# Altium schematic sheet Databus.SchDoc: S88-N Occupancy Detector
size A4; DrawnBy: Sem Kirkels; DocumentNumber: 23P001S01; Revision: V1; SheetNumber: 1; SheetTotal: 6
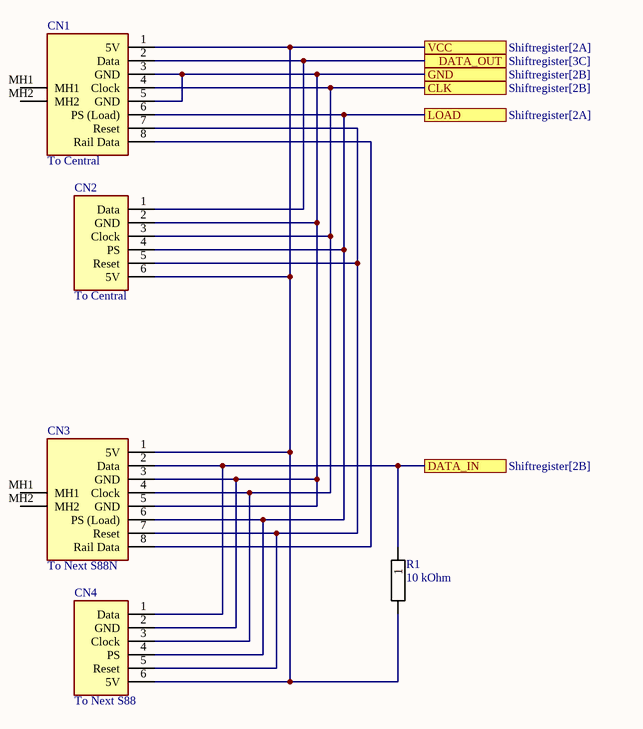
[diagram p0: Databus.SchDoc]

## Parts
CN1  To Central  [RJ45_Connector]
CN2  To Central  [6 pin header]
CN3  To Next S88N  [RJ45_Connector]
CN4  To Next S88  [6 pin header]
R1  10 kOhm  [1N4007]

## Ports
CLK (see Shiftregister[2B]), DATA_IN (see Shiftregister[2B]), DATA_OUT (see Shiftregister[3C]), GND (see Shiftregister[2B]), LOAD (see Shiftregister[2A]), VCC (see Shiftregister[2A])

## Nets
CLK: CN1.4(Clock) CN2.3(Clock) CN3.4(Clock) CN4.3(Clock) ; port CLK
DATA_IN: CN3.2(Data) CN4.1(Data) R1.1 ; port DATA_IN
DATA_OUT: CN1.2(Data) CN2.1(Data) ; port DATA_OUT
GND: CN1.3(GND) CN1.5(GND) CN2.2(GND) CN3.3(GND) CN3.5(GND) CN4.2(GND) ; port GND
LOAD: CN1.6(PS_(Load)) CN2.4(PS) CN3.6(PS_(Load)) CN4.4(PS) ; port LOAD
VCC: CN1.1(5V) CN2.6(5V) CN3.1(5V) CN4.6(5V) R1.2 ; port VCC
NetCN1_7: CN1.7(Reset) CN2.5(Reset) CN3.7(Reset) CN4.5(Reset)
NetCN1_8: CN1.8(Rail_Data) CN3.8(Rail_Data)

Not connected (* = marked no-connect by the designer): CN1 MH1 MH2; CN3 MH1 MH2

## Library data of the parts
CN1 CN3 = RJ45_Connector: Connector; Manufacturer_Name: Weidmuller; Manufacturer_Part_Number: 2562910000; Datasheet Link: https://catalog.weidmueller.com/catalog/Start.do?localeId=en&ObjectID=2562910000; Height: 13.76mm; Mouser Part Number: 470-2562910000; Mouser Price/Stock: https://www.mouser.co.uk/ProductDetail/Weidmuller/2562910000?qs=w%2Fv1CP2dgqr4xNEXLArdDQ%3D%3D
CN2 CN4 = 6 pin header: 78511-406; Manufacturer_Name: Amphenol Communication Solutions; Datasheet Link: https://cdn.amphenol-cs.com/media/wysiwyg/files/drawing/68000.pdf; Height: 10.62mm; Manufacturer_Part_Number: 78511-406; Mouser Part Number: 649-78511-406; Mouser Price/Stock: https://www.mouser.co.uk/ProductDetail/Amphenol-FCI/78511-406?qs=44C8ns5dLY9MkbPan6dMVA%3D%3D; Arrow Part Number: 78511-406; Arrow Price/Stock: https://www.arrow.com/en/products/78511-406/amphenol-fci
R1 = Resistor: NexarPartId: 43026420; Power Rating: 3W; Tolerance: 5%; Temperature Coefficient: -10ppm/°C; Resistance: 8.2Ω; Thickness: 4.8006mm; Radiation Hardening: No; Min Operating Temperature: -40°C; Case/Package: Axial; Packaging: Tape & Box (TB); Termination: Axial; Width: 4.8006mm; Military Standard: Not; Diameter: 4.8mm; RoHS: Compliant; Contact Plating: Tin; Composition: Wirewound; Features: Flame Retardant Coating; Number of Terminations: 2; Length: 13mm; Max Power Dissipation: 3W; Mount: Through Hole; Max Operating Temperature: 200°C